# EasyEDA schematic SCH_61配列.json
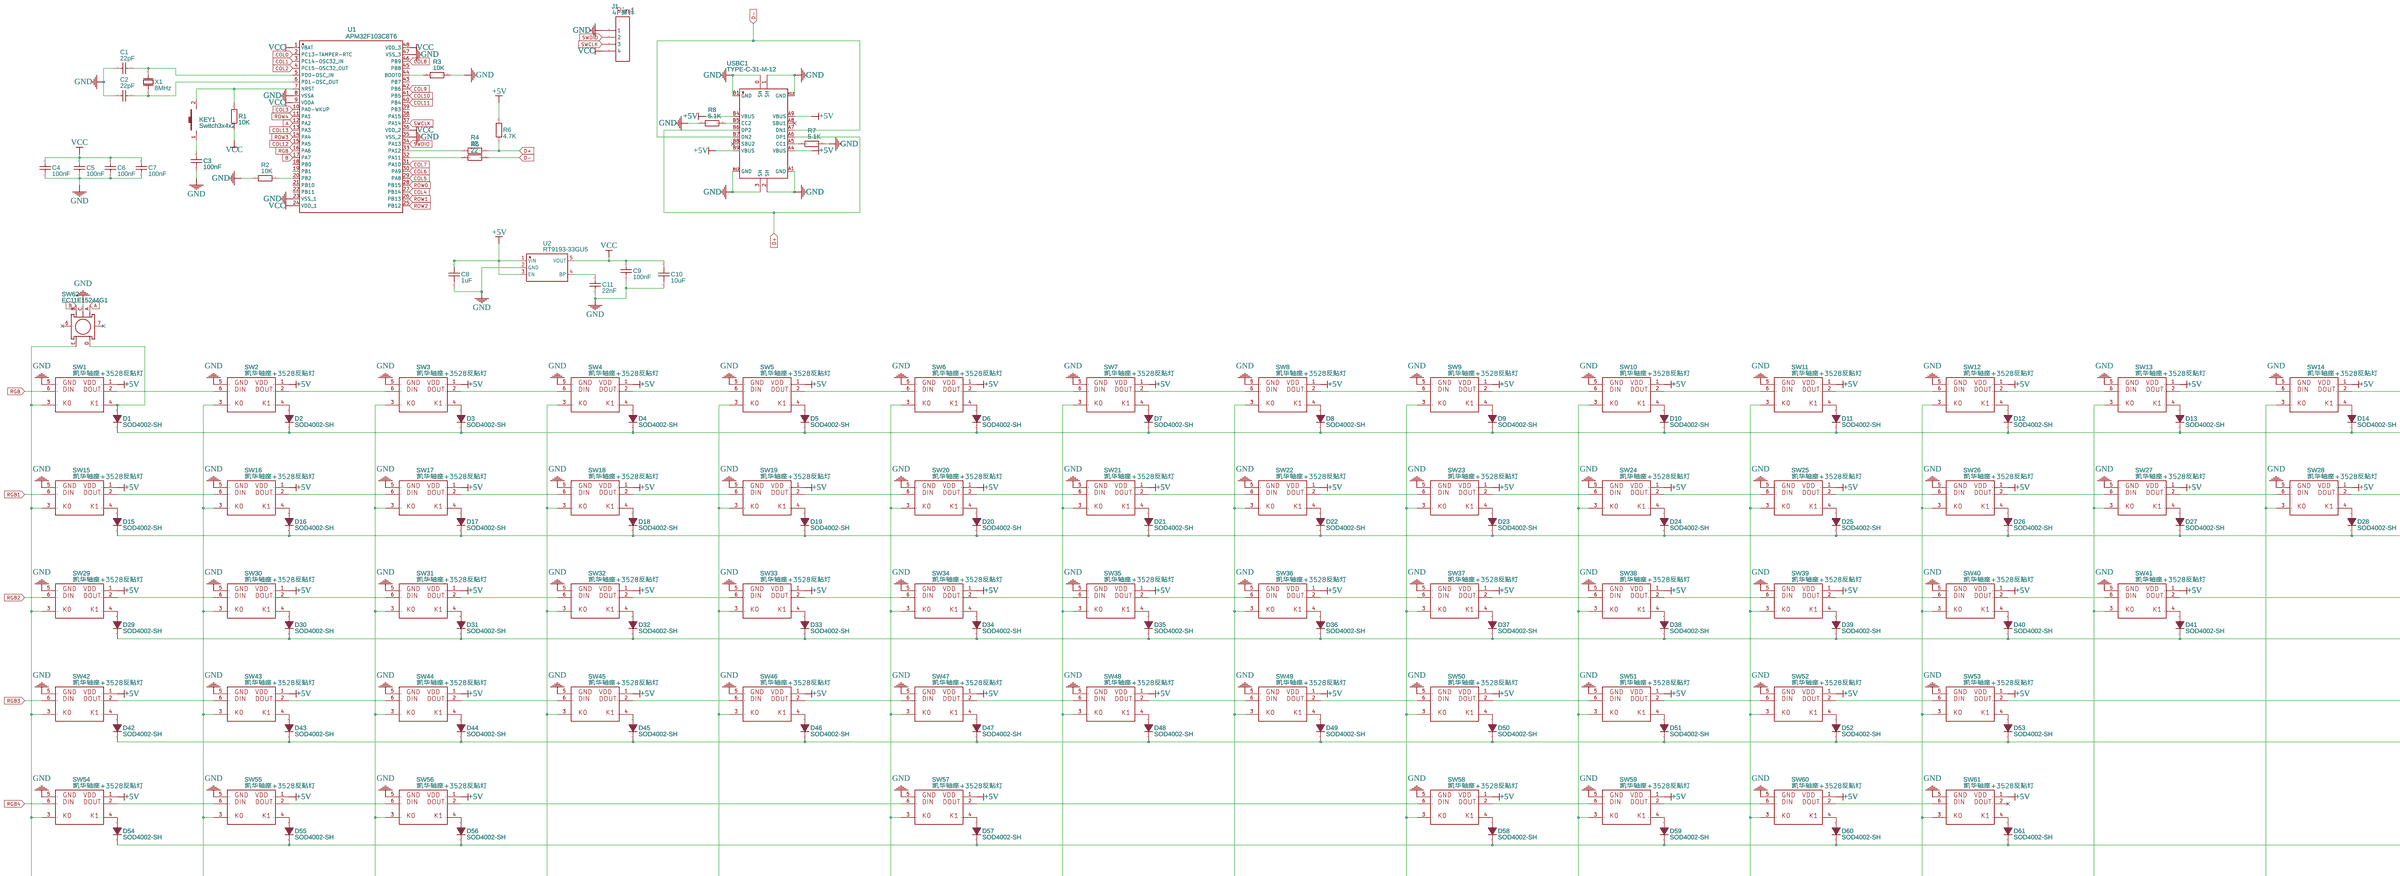
[diagram p0: schematic sheet]

## Parts
C1  22pF  [C0805]
C2  22pF  [C0805]
C3  100nF  [C0805]
C4  100nF  [C0805]
C5  100nF  [C0805]
C6  100nF  [C0805]
C7  100nF  [C0805]
C8  1uF  [C0805]
C9  100nF  [C0805]
C10  10uF  [C0805]
C11  22nF  [C0805]
D1  SOD4002-SH  [SOD-123F_L2.8-W1.8-LS3.7-RD]
D2  SOD4002-SH  [SOD-123F_L2.8-W1.8-LS3.7-RD]
D3  SOD4002-SH  [SOD-123F_L2.8-W1.8-LS3.7-RD]
D4  SOD4002-SH  [SOD-123F_L2.8-W1.8-LS3.7-RD]
D5  SOD4002-SH  [SOD-123F_L2.8-W1.8-LS3.7-RD]
D6  SOD4002-SH  [SOD-123F_L2.8-W1.8-LS3.7-RD]
D7  SOD4002-SH  [SOD-123F_L2.8-W1.8-LS3.7-RD]
D8  SOD4002-SH  [SOD-123F_L2.8-W1.8-LS3.7-RD]
D9  SOD4002-SH  [SOD-123F_L2.8-W1.8-LS3.7-RD]
D10  SOD4002-SH  [SOD-123F_L2.8-W1.8-LS3.7-RD]
D11  SOD4002-SH  [SOD-123F_L2.8-W1.8-LS3.7-RD]
D12  SOD4002-SH  [SOD-123F_L2.8-W1.8-LS3.7-RD]
D13  SOD4002-SH  [SOD-123F_L2.8-W1.8-LS3.7-RD]
D14  SOD4002-SH  [SOD-123F_L2.8-W1.8-LS3.7-RD]
D15  SOD4002-SH  [SOD-123F_L2.8-W1.8-LS3.7-RD]
D16  SOD4002-SH  [SOD-123F_L2.8-W1.8-LS3.7-RD]
D17  SOD4002-SH  [SOD-123F_L2.8-W1.8-LS3.7-RD]
D18  SOD4002-SH  [SOD-123F_L2.8-W1.8-LS3.7-RD]
D19  SOD4002-SH  [SOD-123F_L2.8-W1.8-LS3.7-RD]
D20  SOD4002-SH  [SOD-123F_L2.8-W1.8-LS3.7-RD]
D21  SOD4002-SH  [SOD-123F_L2.8-W1.8-LS3.7-RD]
D22  SOD4002-SH  [SOD-123F_L2.8-W1.8-LS3.7-RD]
D23  SOD4002-SH  [SOD-123F_L2.8-W1.8-LS3.7-RD]
D24  SOD4002-SH  [SOD-123F_L2.8-W1.8-LS3.7-RD]
D25  SOD4002-SH  [SOD-123F_L2.8-W1.8-LS3.7-RD]
D26  SOD4002-SH  [SOD-123F_L2.8-W1.8-LS3.7-RD]
D27  SOD4002-SH  [SOD-123F_L2.8-W1.8-LS3.7-RD]
D28  SOD4002-SH  [SOD-123F_L2.8-W1.8-LS3.7-RD]
D29  SOD4002-SH  [SOD-123F_L2.8-W1.8-LS3.7-RD]
D30  SOD4002-SH  [SOD-123F_L2.8-W1.8-LS3.7-RD]
D31  SOD4002-SH  [SOD-123F_L2.8-W1.8-LS3.7-RD]
D32  SOD4002-SH  [SOD-123F_L2.8-W1.8-LS3.7-RD]
D33  SOD4002-SH  [SOD-123F_L2.8-W1.8-LS3.7-RD]
D34  SOD4002-SH  [SOD-123F_L2.8-W1.8-LS3.7-RD]
D35  SOD4002-SH  [SOD-123F_L2.8-W1.8-LS3.7-RD]
D36  SOD4002-SH  [SOD-123F_L2.8-W1.8-LS3.7-RD]
D37  SOD4002-SH  [SOD-123F_L2.8-W1.8-LS3.7-RD]
D38  SOD4002-SH  [SOD-123F_L2.8-W1.8-LS3.7-RD]
D39  SOD4002-SH  [SOD-123F_L2.8-W1.8-LS3.7-RD]
D40  SOD4002-SH  [SOD-123F_L2.8-W1.8-LS3.7-RD]
D41  SOD4002-SH  [SOD-123F_L2.8-W1.8-LS3.7-RD]
D42  SOD4002-SH  [SOD-123F_L2.8-W1.8-LS3.7-RD]
D43  SOD4002-SH  [SOD-123F_L2.8-W1.8-LS3.7-RD]
D44  SOD4002-SH  [SOD-123F_L2.8-W1.8-LS3.7-RD]
D45  SOD4002-SH  [SOD-123F_L2.8-W1.8-LS3.7-RD]
D46  SOD4002-SH  [SOD-123F_L2.8-W1.8-LS3.7-RD]
D47  SOD4002-SH  [SOD-123F_L2.8-W1.8-LS3.7-RD]
D48  SOD4002-SH  [SOD-123F_L2.8-W1.8-LS3.7-RD]
D49  SOD4002-SH  [SOD-123F_L2.8-W1.8-LS3.7-RD]
D50  SOD4002-SH  [SOD-123F_L2.8-W1.8-LS3.7-RD]
D51  SOD4002-SH  [SOD-123F_L2.8-W1.8-LS3.7-RD]
D52  SOD4002-SH  [SOD-123F_L2.8-W1.8-LS3.7-RD]
D53  SOD4002-SH  [SOD-123F_L2.8-W1.8-LS3.7-RD]
D54  SOD4002-SH  [SOD-123F_L2.8-W1.8-LS3.7-RD]
D55  SOD4002-SH  [SOD-123F_L2.8-W1.8-LS3.7-RD]
D56  SOD4002-SH  [SOD-123F_L2.8-W1.8-LS3.7-RD]
D57  SOD4002-SH  [SOD-123F_L2.8-W1.8-LS3.7-RD]
D58  SOD4002-SH  [SOD-123F_L2.8-W1.8-LS3.7-RD]
D59  SOD4002-SH  [SOD-123F_L2.8-W1.8-LS3.7-RD]
D60  SOD4002-SH  [SOD-123F_L2.8-W1.8-LS3.7-RD]
D61  SOD4002-SH  [SOD-123F_L2.8-W1.8-LS3.7-RD]
J1  4P排针  [4PIN排针]
KEY1  Switch3x4x2  [SW-SMD_L4.0-W2.9-LS5.0]
R1  10K  [R0805]
R2  10K  [R0805]
R3  10K  [R0805]
R4  22  [R0805]
R5  22  [R0805]
R6  4.7K  [R0805]
R7  5.1K  [R0805]
R8  5.1K  [R0805]
SW1  凯华轴座+3528反贴灯  [凯华轴座+3528反贴灯_无丝印]
SW2  凯华轴座+3528反贴灯  [凯华轴座+3528反贴灯_无丝印]
SW3  凯华轴座+3528反贴灯  [凯华轴座+3528反贴灯_无丝印]
SW4  凯华轴座+3528反贴灯  [凯华轴座+3528反贴灯_无丝印]
SW5  凯华轴座+3528反贴灯  [凯华轴座+3528反贴灯_无丝印]
SW6  凯华轴座+3528反贴灯  [凯华轴座+3528反贴灯_无丝印]
SW7  凯华轴座+3528反贴灯  [凯华轴座+3528反贴灯_无丝印]
SW8  凯华轴座+3528反贴灯  [凯华轴座+3528反贴灯_无丝印]
SW9  凯华轴座+3528反贴灯  [凯华轴座+3528反贴灯_无丝印]
SW10  凯华轴座+3528反贴灯  [凯华轴座+3528反贴灯_无丝印]
SW11  凯华轴座+3528反贴灯  [凯华轴座+3528反贴灯_无丝印]
SW12  凯华轴座+3528反贴灯  [凯华轴座+3528反贴灯_无丝印]
SW13  凯华轴座+3528反贴灯  [凯华轴座+3528反贴灯_无丝印]
SW14  凯华轴座+3528反贴灯  [凯华轴座+3528反贴灯_无丝印]
SW15  凯华轴座+3528反贴灯  [凯华轴座+3528反贴灯_无丝印]
SW16  凯华轴座+3528反贴灯  [凯华轴座+3528反贴灯_无丝印]
SW17  凯华轴座+3528反贴灯  [凯华轴座+3528反贴灯_无丝印]
SW18  凯华轴座+3528反贴灯  [凯华轴座+3528反贴灯_无丝印]
SW19  凯华轴座+3528反贴灯  [凯华轴座+3528反贴灯_无丝印]
SW20  凯华轴座+3528反贴灯  [凯华轴座+3528反贴灯_无丝印]
SW21  凯华轴座+3528反贴灯  [凯华轴座+3528反贴灯_无丝印]
SW22  凯华轴座+3528反贴灯  [凯华轴座+3528反贴灯_无丝印]
SW23  凯华轴座+3528反贴灯  [凯华轴座+3528反贴灯_无丝印]
SW24  凯华轴座+3528反贴灯  [凯华轴座+3528反贴灯_无丝印]
SW25  凯华轴座+3528反贴灯  [凯华轴座+3528反贴灯_无丝印]
SW26  凯华轴座+3528反贴灯  [凯华轴座+3528反贴灯_无丝印]
SW27  凯华轴座+3528反贴灯  [凯华轴座+3528反贴灯_无丝印]
SW28  凯华轴座+3528反贴灯  [凯华轴座+3528反贴灯_无丝印]
SW29  凯华轴座+3528反贴灯  [凯华轴座+3528反贴灯_无丝印]
SW30  凯华轴座+3528反贴灯  [凯华轴座+3528反贴灯_无丝印]
SW31  凯华轴座+3528反贴灯  [凯华轴座+3528反贴灯_无丝印]
SW32  凯华轴座+3528反贴灯  [凯华轴座+3528反贴灯_无丝印]
SW33  凯华轴座+3528反贴灯  [凯华轴座+3528反贴灯_无丝印]
SW34  凯华轴座+3528反贴灯  [凯华轴座+3528反贴灯_无丝印]
SW35  凯华轴座+3528反贴灯  [凯华轴座+3528反贴灯_无丝印]
SW36  凯华轴座+3528反贴灯  [凯华轴座+3528反贴灯_无丝印]
SW37  凯华轴座+3528反贴灯  [凯华轴座+3528反贴灯_无丝印]
SW38  凯华轴座+3528反贴灯  [凯华轴座+3528反贴灯_无丝印]
SW39  凯华轴座+3528反贴灯  [凯华轴座+3528反贴灯_无丝印]
SW40  凯华轴座+3528反贴灯  [凯华轴座+3528反贴灯_无丝印]
SW41  凯华轴座+3528反贴灯  [凯华轴座+3528反贴灯_无丝印]
SW42  凯华轴座+3528反贴灯  [凯华轴座+3528反贴灯_无丝印]
SW43  凯华轴座+3528反贴灯  [凯华轴座+3528反贴灯_无丝印]
SW44  凯华轴座+3528反贴灯  [凯华轴座+3528反贴灯_无丝印]
SW45  凯华轴座+3528反贴灯  [凯华轴座+3528反贴灯_无丝印]
SW46  凯华轴座+3528反贴灯  [凯华轴座+3528反贴灯_无丝印]
SW47  凯华轴座+3528反贴灯  [凯华轴座+3528反贴灯_无丝印]
SW48  凯华轴座+3528反贴灯  [凯华轴座+3528反贴灯_无丝印]
SW49  凯华轴座+3528反贴灯  [凯华轴座+3528反贴灯_无丝印]
SW50  凯华轴座+3528反贴灯  [凯华轴座+3528反贴灯_无丝印]
SW51  凯华轴座+3528反贴灯  [凯华轴座+3528反贴灯_无丝印]
SW52  凯华轴座+3528反贴灯  [凯华轴座+3528反贴灯_无丝印]
SW53  凯华轴座+3528反贴灯  [凯华轴座+3528反贴灯_无丝印]
SW54  凯华轴座+3528反贴灯  [凯华轴座+3528反贴灯_无丝印]
SW55  凯华轴座+3528反贴灯  [凯华轴座+3528反贴灯_无丝印]
SW56  凯华轴座+3528反贴灯  [凯华轴座+3528反贴灯_无丝印]
SW57  凯华轴座+3528反贴灯  [凯华轴座+3528反贴灯_无丝印]
SW58  凯华轴座+3528反贴灯  [凯华轴座+3528反贴灯_无丝印]
SW59  凯华轴座+3528反贴灯  [凯华轴座+3528反贴灯_无丝印]
SW60  凯华轴座+3528反贴灯  [凯华轴座+3528反贴灯_无丝印]
SW61  凯华轴座+3528反贴灯  [凯华轴座+3528反贴灯_无丝印]
SW62  EC11E15244G1  [MY_EC11]
U1  APM32F103C8T6  [LQFP-48_L7.0-W7.0-P0.50-LS9.0-BL]
U2  RT9193-33GU5  [SC-70-5_L2.1-W1.3-P0.65-LS2.1-BL]
USBC1  TYPE-C-31-M-12  [USB-C_SMD-TYPE-C-31-M-12]
X1  8MHz  [CRYSTAL-SMD_L5.0-W3.2]

## Library data of the parts
C1 C2 = 0805CG220J500NT: Supplier: LCSC; Manufacturer: FH; Supplier Part: C38143; JLCPCB Part Class: Extended Part
C3-C7 C9 = CL21B104KBCNNNC: Supplier: LCSC; Manufacturer: SAMSUNG(三星); Supplier Part: C1711; JLCPCB Part Class: Extended Part
C8 = CL21B105KBFVPNE: Supplier: LCSC; Supplier Part: C307362; Manufacturer: SAMSUNG(三星); Contributor: LCSC; JLCPCB Part Class: Extended Part
C10 = CL21B106KPQNFNE: Supplier: LCSC; Supplier Part: C307538; Manufacturer: SAMSUNG(三星); Contributor: LCSC; JLCPCB Part Class: Extended Part
C11 = CL21B223KBANNNC: Supplier: LCSC; Manufacturer: SAMSUNG(三星); Supplier Part: C1729; JLCPCB Part Class: Basic Part
D1-D61 = SOD4002-SH: Supplier: LCSC; Manufacturer: LRC; Contributor: LCSC; Supplier Part: C154996; JLCPCB Part Class: Extended Part
J1 = 4P排针: Contributor: tism_01
KEY1 = Switch3x4x2: Supplier: LCSC; Manufacturer: ReliaPro; Supplier Part: C26638; JLCPCB Part Class: Extended Part
R1-R3 = RC0805FR-0710KL: Supplier: LCSC; Manufacturer: YAGEO; Supplier Part: C84376; JLCPCB Part Class: Extended Part; Resistance: 10kΩ
R4 R5 = RC0805FR-0722RL: Supplier: LCSC; Manufacturer: YAGEO(国巨); Supplier Part: C107702; JLCPCB Part Class: Extended Part; Resistance: 22Ω
R6 = RC0805JR-074K7L: Supplier: LCSC; Manufacturer: YAGEO(国巨); Supplier Part: C105427; JLCPCB Part Class: Extended Part; Resistance: 4.7kΩ
R7 R8 = RC0805FR-075K1L: Supplier: LCSC; Manufacturer: YAGEO(国巨); Supplier Part: C84375; JLCPCB Part Class: Extended Part; Resistance: 5.1kΩ
SW1-SW61 = 凯华轴座+3528反贴灯: Contributor: 1scan
SW62 = EC11E15244G1: Supplier: LCSC; Supplier Part: C370970; Manufacturer: ALPS Electric; Contributor: LCSC; JLCPCB Part Class: Extended Part
U1 = APM32F103C8T6: Supplier: LCSC; Supplier Part: C393540; Manufacturer: Geehy(珠海极海); Contributor: LCSC; JLCPCB Part Class: Extended Part
U2 = RT9193-33GU5: Supplier: LCSC; Supplier Part: C425797; Manufacturer: RICHTEK(台湾立锜); Contributor: LCSC; JLCPCB Part Class: Extended Part
USBC1 = TYPE-C-31-M-12: Supplier: LCSC; Supplier Part: C165948; Manufacturer: 韩国韩荣; Contributor: LCSC; JLCPCB Part Class: Extended Part
X1 = X50328MSB2GI: Supplier: LCSC; Manufacturer: YXC(扬兴晶振); Supplier Part: C115962; JLCPCB Part Class: Basic Part

## Nets
+5V: C8.2 R6.2 SW1.1 SW2.1 SW3.1 SW4.1 SW5.1 SW6.1 SW7.1 SW8.1 SW9.1 SW10.1 SW11.1 SW12.1 SW13.1 SW14.1 SW15.1 SW16.1 SW17.1 SW18.1 SW19.1 SW20.1 SW21.1 SW22.1 SW23.1 SW24.1 SW25.1 SW26.1 SW27.1 SW28.1 SW29.1 SW30.1 SW31.1 SW32.1 SW33.1 SW34.1 SW35.1 SW36.1 SW37.1 SW38.1 SW39.1 SW40.1 SW41.1 SW42.1 SW43.1 SW44.1 SW45.1 SW46.1 SW47.1 SW48.1 SW49.1 SW50.1 SW51.1 SW52.1 SW53.1 SW54.1 SW55.1 SW56.1 SW57.1 SW58.1 SW59.1 SW60.1 SW61.1 U2.1(VIN) U2.3(EN) USBC1.A4(VBUS) USBC1.A9(VBUS) USBC1.B4(VBUS) USBC1.B9(VBUS)
GND: C1.1 C2.1 C3.1 C4.1 C5.1 C6.1 C7.1 C8.1 C9.1 C10.2 C11.1 J1.1 R2.2 R3.1 R7.2 R8.1 SW1.5 SW2.5 SW3.5 SW4.5 SW5.5 SW6.5 SW7.5 SW8.5 SW9.5 SW10.5 SW11.5 SW12.5 SW13.5 SW14.5 SW15.5 SW16.5 SW17.5 SW18.5 SW19.5 SW20.5 SW21.5 SW22.5 SW23.5 SW24.5 SW25.5 SW26.5 SW27.5 SW28.5 SW29.5 SW30.5 SW31.5 SW32.5 SW33.5 SW34.5 SW35.5 SW36.5 SW37.5 SW38.5 SW39.5 SW40.5 SW41.5 SW42.5 SW43.5 SW44.5 SW45.5 SW46.5 SW47.5 SW48.5 SW49.5 SW50.5 SW51.5 SW52.5 SW53.5 SW54.5 SW55.5 SW56.5 SW57.5 SW58.5 SW59.5 SW60.5 SW61.5 SW62.C U1.8(VSSA) U1.23(VSS_1) U1.35(VSS_2) U1.47(VSS_3) U2.2(GND) USBC1.0(SH) USBC1.1(SH) USBC1.2(SH) USBC1.3(SH) USBC1.A1(GND) USBC1.A12(GND) USBC1.B1(GND) USBC1.B12(GND)
VCC: C4.2 C5.2 C6.2 C7.2 C9.2 C10.1 J1.4 R1.1 U1.1(VBAT) U1.9(VDDA) U1.24(VDD_1) U1.36(VDD_2) U1.48(VDD_3) U2.5(VOUT)
A: SW62.A U1.12(PA2)
B: SW62.B U1.17(PA7)
COL0: SW1.3 SW15.3 SW29.3 SW42.3 SW54.3 SW62.E U1.2(PC13-TAMPER-RTC)
COL1: SW2.3 SW16.3 SW30.3 SW43.3 SW55.3 U1.3(PC14-OSC32_IN)
COL2: SW3.3 SW17.3 SW31.3 SW44.3 SW56.3 U1.4(PC15-OSC32_OUT)
COL3: SW4.3 SW18.3 SW32.3 SW45.3 U1.10(PA0-WKUP)
COL4: SW5.3 SW19.3 SW33.3 SW46.3 U1.27(PB14)
COL5: SW6.3 SW20.3 SW34.3 SW47.3 SW57.3 U1.29(PA8)
COL6: SW7.3 SW21.3 SW35.3 SW48.3 U1.30(PA9)
COL7: SW8.3 SW22.3 SW36.3 SW49.3 U1.31(PA10)
COL8: SW9.3 SW23.3 SW37.3 SW50.3 SW58.3 U1.46(PB9)
COL9: SW10.3 SW24.3 SW38.3 SW51.3 SW59.3 U1.42(PB6)
COL10: SW11.3 SW25.3 SW39.3 SW52.3 SW60.3 U1.41(PB5)
COL11: SW12.3 SW26.3 SW40.3 SW53.3 SW61.3 U1.40(PB4)
COL12: SW13.3 SW27.3 SW41.3 U1.15(PA5)
COL13: SW14.3 SW28.3 U1.13(PA3)
D+: R4.2 R6.1 USBC1.A6(DP1) USBC1.B6(DP2)
D-: R5.2 USBC1.A7(DN1) USBC1.B7(DN2)
RGB: SW1.6 U1.16(PA6)
RGB1: SW14.2 SW15.6
RGB2: SW28.2 SW29.6
RGB3: SW41.2 SW42.6
RGB4: SW53.2 SW54.6
ROW0: D1.1(K) D2.1(K) D3.1(K) D4.1(K) D5.1(K) D6.1(K) D7.1(K) D8.1(K) D9.1(K) D10.1(K) D11.1(K) D12.1(K) D13.1(K) D14.1(K) U1.28(PB15)
ROW1: D15.1(K) D16.1(K) D17.1(K) D18.1(K) D19.1(K) D20.1(K) D21.1(K) D22.1(K) D23.1(K) D24.1(K) D25.1(K) D26.1(K) D27.1(K) D28.1(K) U1.26(PB13)
ROW2: D29.1(K) D30.1(K) D31.1(K) D32.1(K) D33.1(K) D34.1(K) D35.1(K) D36.1(K) D37.1(K) D38.1(K) D39.1(K) D40.1(K) D41.1(K) U1.25(PB12)
ROW3: D42.1(K) D43.1(K) D44.1(K) D45.1(K) D46.1(K) D47.1(K) D48.1(K) D49.1(K) D50.1(K) D51.1(K) D52.1(K) D53.1(K) U1.14(PA4)
ROW4: D54.1(K) D55.1(K) D56.1(K) D57.1(K) D58.1(K) D59.1(K) D60.1(K) D61.1(K) U1.11(PA1)
SWCLK: J1.3 U1.37(PA14)
SWDIO: J1.2 U1.34(PA13)
Net-(C1-2): C1.2 U1.5(PD0-OSC_IN) X1.2(OSC2)
Net-(C2-2): C2.2 U1.6(PD1-OSC_OUT) X1.1(OSC1)
Net-(C3-2): C3.2 KEY1.1
Net-(C11-2): C11.2 U2.4(BP)
Net-(D1-2): D1.2(A) SW1.4 SW62.D
Net-(D2-2): D2.2(A) SW2.4
Net-(D3-2): D3.2(A) SW3.4
Net-(D4-2): D4.2(A) SW4.4
Net-(D5-2): D5.2(A) SW5.4
Net-(D6-2): D6.2(A) SW6.4
Net-(D7-2): D7.2(A) SW7.4
Net-(D8-2): D8.2(A) SW8.4
Net-(D9-2): D9.2(A) SW9.4
Net-(D10-2): D10.2(A) SW10.4
Net-(D11-2): D11.2(A) SW11.4
Net-(D12-2): D12.2(A) SW12.4
Net-(D13-2): D13.2(A) SW13.4
Net-(D14-2): D14.2(A) SW14.4
Net-(D15-2): D15.2(A) SW15.4
Net-(D16-2): D16.2(A) SW16.4
Net-(D17-2): D17.2(A) SW17.4
Net-(D18-2): D18.2(A) SW18.4
Net-(D19-2): D19.2(A) SW19.4
Net-(D20-2): D20.2(A) SW20.4
Net-(D21-2): D21.2(A) SW21.4
Net-(D22-2): D22.2(A) SW22.4
Net-(D23-2): D23.2(A) SW23.4
Net-(D24-2): D24.2(A) SW24.4
Net-(D25-2): D25.2(A) SW25.4
Net-(D26-2): D26.2(A) SW26.4
Net-(D27-2): D27.2(A) SW27.4
Net-(D28-2): D28.2(A) SW28.4
Net-(D29-2): D29.2(A) SW29.4
Net-(D30-2): D30.2(A) SW30.4
Net-(D31-2): D31.2(A) SW31.4
Net-(D32-2): D32.2(A) SW32.4
Net-(D33-2): D33.2(A) SW33.4
Net-(D34-2): D34.2(A) SW34.4
Net-(D35-2): D35.2(A) SW35.4
Net-(D36-2): D36.2(A) SW36.4
Net-(D37-2): D37.2(A) SW37.4
Net-(D38-2): D38.2(A) SW38.4
Net-(D39-2): D39.2(A) SW39.4
Net-(D40-2): D40.2(A) SW40.4
Net-(D41-2): D41.2(A) SW41.4
Net-(D42-2): D42.2(A) SW42.4
Net-(D43-2): D43.2(A) SW43.4
Net-(D44-2): D44.2(A) SW44.4
Net-(D45-2): D45.2(A) SW45.4
Net-(D46-2): D46.2(A) SW46.4
Net-(D47-2): D47.2(A) SW47.4
Net-(D48-2): D48.2(A) SW48.4
Net-(D49-2): D49.2(A) SW49.4
Net-(D50-2): D50.2(A) SW50.4
Net-(D51-2): D51.2(A) SW51.4
Net-(D52-2): D52.2(A) SW52.4
Net-(D53-2): D53.2(A) SW53.4
Net-(D54-2): D54.2(A) SW54.4
Net-(D55-2): D55.2(A) SW55.4
Net-(D56-2): D56.2(A) SW56.4
Net-(D57-2): D57.2(A) SW57.4
Net-(D58-2): D58.2(A) SW58.4
Net-(D59-2): D59.2(A) SW59.4
Net-(D60-2): D60.2(A) SW60.4
Net-(D61-2): D61.2(A) SW61.4
Net-(KEY1-2): KEY1.2 R1.2 U1.7(NRST)
Net-(R2-1): R2.1 U1.20(PB2)
Net-(R3-2): R3.2 U1.44(BOOT0)
Net-(R4-1): R4.1 U1.33(PA12)
Net-(R5-1): R5.1 U1.32(PA11)
Net-(R7-1): R7.1 USBC1.A5(CC1)
Net-(R8-2): R8.2 USBC1.B5(CC2)
Net-(SW1-2): SW1.2 SW2.6
Net-(SW2-2): SW2.2 SW3.6
Net-(SW3-2): SW3.2 SW4.6
Net-(SW4-2): SW4.2 SW5.6
Net-(SW5-2): SW5.2 SW6.6
Net-(SW6-2): SW6.2 SW7.6
Net-(SW7-2): SW7.2 SW8.6
Net-(SW8-2): SW8.2 SW9.6
Net-(SW9-2): SW9.2 SW10.6
Net-(SW10-2): SW10.2 SW11.6
Net-(SW11-2): SW11.2 SW12.6
Net-(SW12-2): SW12.2 SW13.6
Net-(SW13-2): SW13.2 SW14.6
Net-(SW15-2): SW15.2 SW16.6
Net-(SW16-2): SW16.2 SW17.6
Net-(SW17-2): SW17.2 SW18.6
Net-(SW18-2): SW18.2 SW19.6
Net-(SW19-2): SW19.2 SW20.6
Net-(SW20-2): SW20.2 SW21.6
Net-(SW21-2): SW21.2 SW22.6
Net-(SW22-2): SW22.2 SW23.6
Net-(SW23-2): SW23.2 SW24.6
Net-(SW24-2): SW24.2 SW25.6
Net-(SW25-2): SW25.2 SW26.6
Net-(SW26-2): SW26.2 SW27.6
Net-(SW27-2): SW27.2 SW28.6
Net-(SW29-2): SW29.2 SW30.6
Net-(SW30-2): SW30.2 SW31.6
Net-(SW31-2): SW31.2 SW32.6
Net-(SW32-2): SW32.2 SW33.6
Net-(SW33-2): SW33.2 SW34.6
Net-(SW34-2): SW34.2 SW35.6
Net-(SW35-2): SW35.2 SW36.6
Net-(SW36-2): SW36.2 SW37.6
Net-(SW37-2): SW37.2 SW38.6
Net-(SW38-2): SW38.2 SW39.6
Net-(SW39-2): SW39.2 SW40.6
Net-(SW40-2): SW40.2 SW41.6
Net-(SW42-2): SW42.2 SW43.6
Net-(SW43-2): SW43.2 SW44.6
Net-(SW44-2): SW44.2 SW45.6
Net-(SW45-2): SW45.2 SW46.6
Net-(SW46-2): SW46.2 SW47.6
Net-(SW47-2): SW47.2 SW48.6
Net-(SW48-2): SW48.2 SW49.6
Net-(SW49-2): SW49.2 SW50.6
Net-(SW50-2): SW50.2 SW51.6
Net-(SW51-2): SW51.2 SW52.6
Net-(SW52-2): SW52.2 SW53.6
Net-(SW54-2): SW54.2 SW55.6
Net-(SW55-2): SW55.2 SW56.6
Net-(SW56-2): SW56.2 SW57.6
Net-(SW57-2): SW57.2 SW58.6
Net-(SW58-2): SW58.2 SW59.6
Net-(SW59-2): SW59.2 SW60.6
Net-(SW60-2): SW60.2 SW61.6

Not connected (* = marked no-connect by the designer): SW61 2*; SW62 6* 7*; U1 18(PB0) 19(PB1) 21(PB10) 22(PB11) 38(PA15) 39(PB3) 43(PB7) 45(PB8); USBC1 A8(SBU1)* B8(SBU2)*
